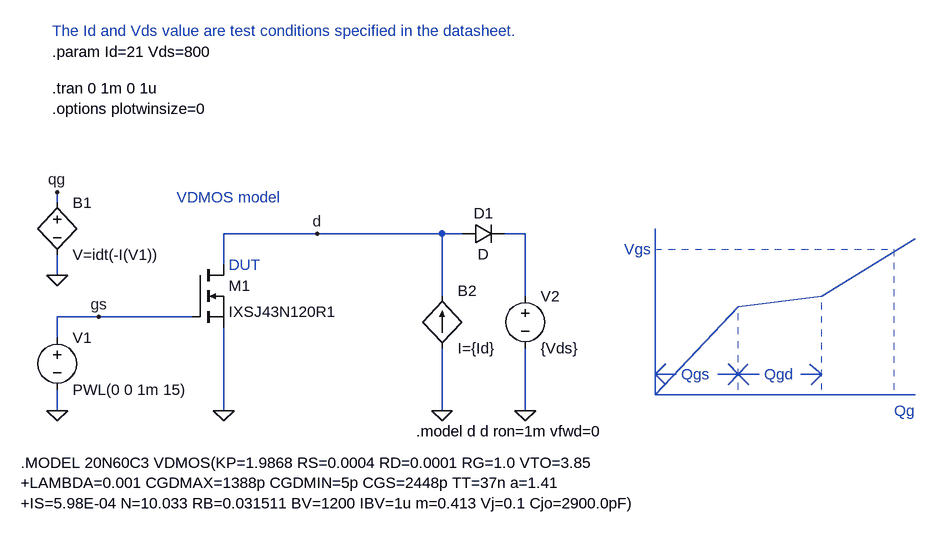
[diagram p0: schematic IXSJ43N120R1_GateCharge.asc]
IXSJ43N120R1_GateCharge.asc, the LTspice schematic file:
Version 4
SHEET 1 2828 1468
WIRE 16 368 16 352
WIRE 416 416 272 416
WIRE 608 416 416 416
WIRE 640 416 608 416
WIRE 736 416 704 416
WIRE 272 464 272 416
WIRE 16 480 16 448
WIRE 608 512 608 416
WIRE 736 512 736 416
WIRE 80 544 16 544
WIRE 224 544 80 544
WIRE 16 576 16 544
WIRE 16 688 16 656
WIRE 272 688 272 560
WIRE 608 688 608 592
WIRE 736 688 736 592
FLAG 608 688 0
FLAG 16 688 0
FLAG 272 688 0
FLAG 16 480 0
FLAG 80 544 gs
FLAG 16 352 qg
FLAG 416 416 d
FLAG 736 688 0
SYMBOL voltage 16 560 R0
WINDOW 123 0 0 Left 0
WINDOW 39 0 0 Left 0
SYMATTR InstName V1
SYMATTR Value PWL(0 0 1m 15)
SYMBOL bv 16 352 R0
SYMATTR InstName B1
SYMATTR Value V=idt(-I(V1))
SYMBOL bi 608 592 M180
WINDOW 0 24 88 Left 0
WINDOW 3 24 0 Left 0
SYMATTR InstName B2
SYMATTR Value I={Id}
SYMBOL diode 640 432 R270
WINDOW 0 32 32 VTop 0
WINDOW 3 0 32 VBottom 0
SYMATTR InstName D1
SYMBOL voltage 736 496 R0
WINDOW 123 0 0 Left 0
WINDOW 39 0 0 Left 0
SYMATTR InstName V2
SYMATTR Value {Vds}
SYMBOL NMOS 224 464 R0
SYMATTR InstName M1
SYMATTR Value IXSJ43N120R1
TEXT 8 192 Left 0 !.tran 0 1m 0 1u
TEXT 976 632 Left 0 ;Qgs
TEXT 1104 632 Left 0 ;Qgd
TEXT 888 440 Left 0 ;Vgs
TEXT 1304 688 Left 0 ;Qg
TEXT 8 224 Left 0 !.options plotwinsize=0
TEXT 200 360 Left 0 ;VDMOS model
TEXT 8 136 Left 0 !.param Id=21 Vds=800
TEXT 568 720 Left 0 !.model d d ron=1m vfwd=0
TEXT 8 104 Left 0 ;The Id and Vds value are test conditions specified in the datasheet.
TEXT 280 464 Left 0 ;DUT
TEXT -40 768 Left 0 !.MODEL 20N60C3 VDMOS(KP=1.9868 RS=0.0004 RD=0.0001 RG=1.0 VTO=3.85 \n+LAMBDA=0.001 CGDMAX=1388p CGDMIN=5p CGS=2448p TT=37n a=1.41\n+IS=5.98E-04 N=10.033 RB=0.031511 BV=1200 IBV=1u m=0.413 Vj=0.1 Cjo=2900.0pF)
LINE Normal 936 664 936 408
LINE Normal 1336 664 936 664
LINE Normal 1064 528 936 664
LINE Normal 1192 512 1064 528
LINE Normal 1336 424 1192 512
LINE Normal 936 440 1304 440 2
LINE Normal 1304 656 1304 440 2
LINE Normal 1064 656 1064 528 2
LINE Normal 1192 656 1192 512 2
LINE Normal 1096 632 1064 632
LINE Normal 1192 632 1160 632
LINE Normal 968 632 936 632
LINE Normal 1078 617 1064 632
LINE Normal 1080 648 1064 632
LINE Normal 1174 617 1192 632
LINE Normal 1176 648 1192 632
LINE Normal 952 616 936 632
LINE Normal 952 648 936 632
LINE Normal 1032 632 1064 632
LINE Normal 1048 616 1064 632
LINE Normal 1048 648 1064 632

The netlist it stands for:
* IXSJ43N120R1_GateCharge.asc
V1 gs 0 PWL(0 0 1m 15)
B1 qg 0 V=idt(-I(V1))
B2 0 d I={Id}
D1 d N001 D
V2 N001 0 {Vds}
M1 d gs 0 0 IXSJ43N120R1
.model D D
.lib standard.dio
.model NMOS NMOS
.model PMOS PMOS
.lib standard.mos
.tran 0 1m 0 1u
* Qgs
* Qgd
* Vgs
* Qg
.options plotwinsize=0
* VDMOS model
.param Id=21 Vds=800
.model d d ron=1m vfwd=0
* The Id and Vds value are test conditions specified in the datasheet.
* DUT
.MODEL 20N60C3 VDMOS(KP=1.9868 RS=0.0004 RD=0.0001 RG=1.0 VTO=3.85
+LAMBDA=0.001 CGDMAX=1388p CGDMIN=5p CGS=2448p TT=37n a=1.41
+IS=5.98E-04 N=10.033 RB=0.031511 BV=1200 IBV=1u m=0.413 Vj=0.1 Cjo=2900.0pF)
.backanno
.end